# EAGLE schematic HW30A (EAGLE 7.5.0)
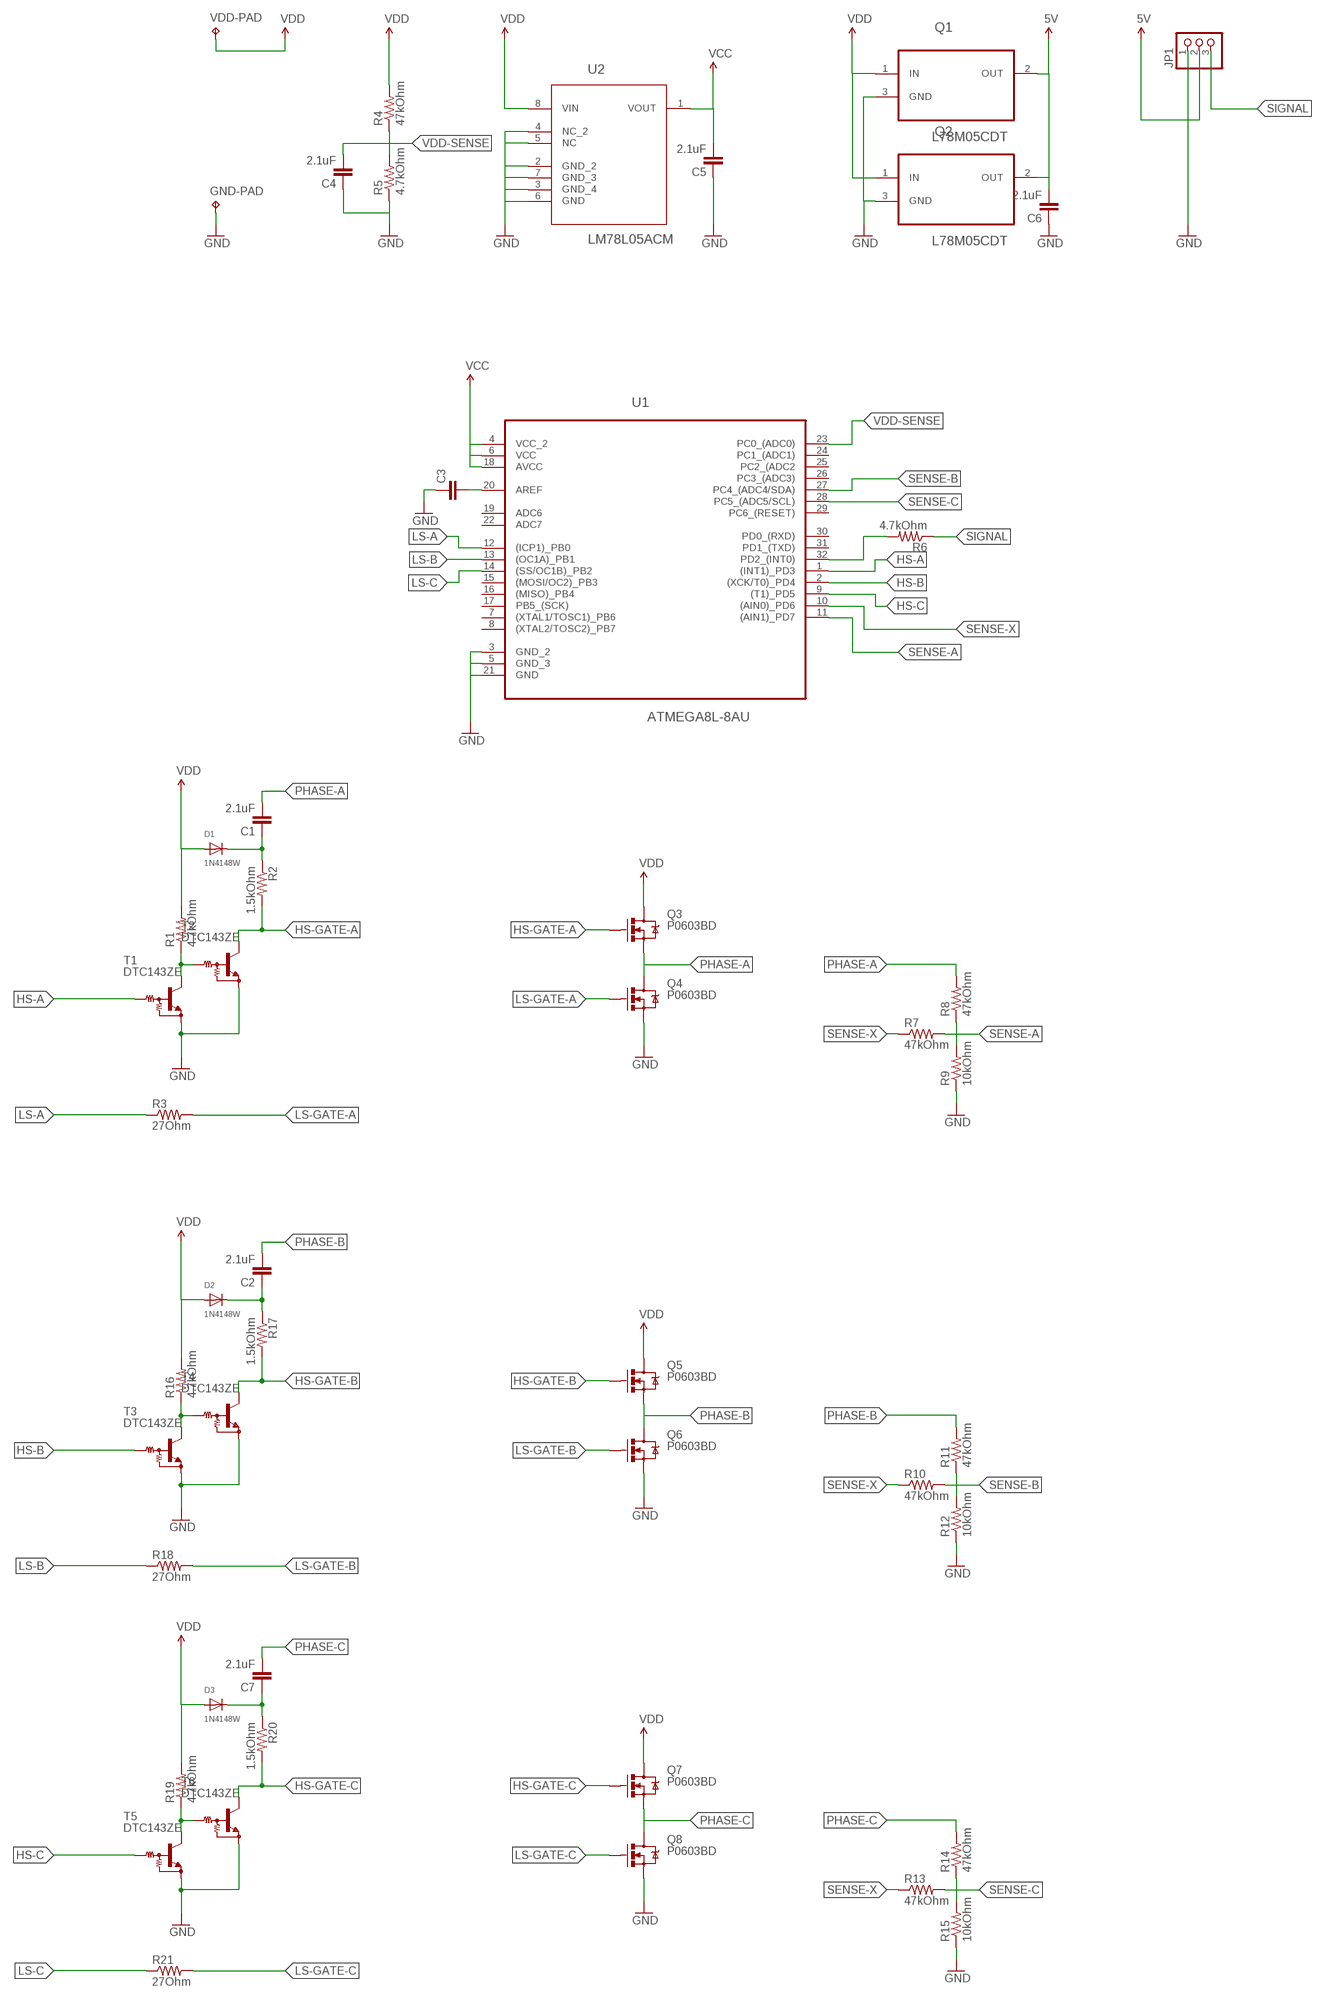
[diagram p0: schematic, sheet 1]

## Parts
C1  2.1uF  C-EUC0805K  [C0805K]
C2  2.1uF  C-EUC0805K  [C0805K]
C3  C-EUC0603K  [C0603K]
C4  2.1uF  C-EUC0805K  [C0805K]
C5  2.1uF  C-EUC0805K  [C0805K]
C6  2.1uF  C-EUC0805K  [C0805K]
C7  2.1uF  C-EUC0805K  [C0805K]
D1  1N4148W  DIODESOD-123  [SOD-123]
D2  1N4148W  DIODESOD-123  [SOD-123]
D3  1N4148W  DIODESOD-123  [SOD-123]
GND-PAD  TPTP20R  [TP20R]
JP1  PINHD-1X3CB  [1X03-CLEANBIG]
Q1  L78M05CDT  [TO225P972X240-3N]
Q2  L78M05CDT  [TO225P972X240-3N]
Q3  P0603BD  MOSFET-NCHANNELFDD8780  [DPAK]
Q4  P0603BD  MOSFET-NCHANNELFDD8780  [DPAK]
Q5  P0603BD  MOSFET-NCHANNELFDD8780  [DPAK]
Q6  P0603BD  MOSFET-NCHANNELFDD8780  [DPAK]
Q7  P0603BD  MOSFET-NCHANNELFDD8780  [DPAK]
Q8  P0603BD  MOSFET-NCHANNELFDD8780  [DPAK]
R1  4.7kOhm  R-US_R0603  [R0603]
R2  1.5kOhm  R-US_R0805  [R0805]
R3  27Ohm  R-US_R0603  [R0603]
R4  47kOhm  R-US_R0603  [R0603]
R5  4.7kOhm  R-US_R0603  [R0603]
R6  4.7kOhm  R-US_R0603  [R0603]
R7  47kOhm  R-US_R0603  [R0603]
R8  47kOhm  R-US_R0603  [R0603]
R9  10kOhm  R-US_R0603  [R0603]
R10  47kOhm  R-US_R0603  [R0603]
R11  47kOhm  R-US_R0603  [R0603]
R12  10kOhm  R-US_R0603  [R0603]
R13  47kOhm  R-US_R0603  [R0603]
R14  47kOhm  R-US_R0603  [R0603]
R15  10kOhm  R-US_R0603  [R0603]
R16  4.7kOhm  R-US_R0603  [R0603]
R17  1.5kOhm  R-US_R0805  [R0805]
R18  27Ohm  R-US_R0603  [R0603]
R19  4.7kOhm  R-US_R0603  [R0603]
R20  1.5kOhm  R-US_R0805  [R0805]
R21  27Ohm  R-US_R0603  [R0603]
T1  DTC143ZE  MUN2211T1-NPN_DRIVER-SC59-BEC  [SC59-BEC]
T2  DTC143ZE  MUN2211T1-NPN_DRIVER-SC59-BEC  [SC59-BEC]
T3  DTC143ZE  MUN2211T1-NPN_DRIVER-SC59-BEC  [SC59-BEC]
T4  DTC143ZE  MUN2211T1-NPN_DRIVER-SC59-BEC  [SC59-BEC]
T5  DTC143ZE  MUN2211T1-NPN_DRIVER-SC59-BEC  [SC59-BEC]
T6  DTC143ZE  MUN2211T1-NPN_DRIVER-SC59-BEC  [SC59-BEC]
U1  ATMEGA8L-8AU  [QFP80P900X900X120-32N]
U2  LM78L05ACM  [SOIC127P620X175-8N]
VDD-PAD  TPTP20R  [TP20R]

## Nets
5V: C6.2 JP1.2 Q1.2(OUT) Q2.2(OUT)
GND: C3.1 C4.1 C5.1 C6.1 GND-PAD.TP JP1.1 Q1.3(GND) Q2.3(GND) Q4.3(S) Q6.3(S) Q8.3(S) R5.1 R9.1 R12.1 R15.1 T1.E T2.E T3.E T4.E T5.E T6.E U1.3(GND_2) U1.5(GND_3) U1.21(GND) U2.2(GND_2) U2.3(GND_4) U2.4(NC_2) U2.5(NC) U2.6(GND) U2.7(GND_3)
HS-A: T1.B U1.1((INT1)_PD3)
HS-B: T3.B U1.2((XCK/T0)_PD4)
HS-C: T5.B U1.9((T1)_PD5)
HS-GATE-A: Q3.1(G) R2.2 T2.C
HS-GATE-B: Q5.1(G) R17.2 T4.C
HS-GATE-C: Q7.1(G) R20.2 T6.C
LS-A: R3.1 U1.12((ICP1)_PB0)
LS-B: R18.1 U1.13((OC1A)_PB1)
LS-C: R21.1 U1.14((SS/OC1B)_PB2)
LS-GATE-A: Q4.1(G) R3.2
LS-GATE-B: Q6.1(G) R18.2
LS-GATE-C: Q8.1(G) R21.2
N$1: R6.1
N$2: R1.1 T1.C T2.B
N$4: C1.1 D1.C R2.1
N$5: R16.1 T3.C T4.B
N$6: C3.2 U1.20(AREF)
N$7: C2.1 D2.C R17.1
N$9: R19.1 T5.C T6.B
N$10: C7.1 D3.C R20.1
PHASE-A: C1.2 Q3.3(S) Q4.4(D) R8.2
PHASE-B: C2.2 Q5.3(S) Q6.4(D) R11.2
PHASE-C: C7.2 Q7.3(S) Q8.4(D) R14.2
SENSE-A: R7.2 R8.1 R9.2 U1.11((AIN1)_PD7)
SENSE-B: R10.2 R11.1 R12.2 U1.27(PC4_(ADC4/SDA))
SENSE-C: R13.2 R14.1 R15.2 U1.28(PC5_(ADC5/SCL))
SENSE-X: R7.1 R10.1 R13.1 U1.10((AIN0)_PD6)
SIGNAL: JP1.3 R6.2 U1.32(PD2_(INT0))
VCC: C5.2 U1.4(VCC_2) U1.6(VCC) U1.18(AVCC) U2.1(VOUT)
VDD: D1.A D2.A D3.A Q1.1(IN) Q2.1(IN) Q3.4(D) Q5.4(D) Q7.4(D) R1.2 R4.2 R16.2 R19.2 U2.8(VIN) VDD-PAD.TP
VDD-SENSE: C4.2 R4.1 R5.2 U1.23(PC0_(ADC0))
Unconnected: U1.7((XTAL1/TOSC1)_PB6) U1.8((XTAL2/TOSC2)_PB7) U1.15((MOSI/OC2)_PB3) U1.16((MISO)_PB4) U1.17(PB5_(SCK)) U1.19(ADC6) U1.22(ADC7) U1.24(PC1_(ADC1)) U1.25(PC2_(ADC2) U1.26(PC3_(ADC3)) U1.29(PC6_(RESET)) U1.30(PD0_(RXD)) U1.31(PD1_(TXD))

## Library data of the parts
C1 C2 C4-C7 = resistor:C-EU: CAPACITOR, European symbol
C3 = rcl:C-EU: CAPACITOR, European symbol
D1-D3 = adafruit:DIODE: Diode SMADIODE - SMA Surface Mount Package 20V 1A Schottky Diode Digikey: 641-1014-6-ND DO-1N4148 - Through Hole Small Current Diode SOD-123 20V 1 A (.5mV Vf) Schottky Diode - Digikey: MBRX120TPMSCT-ND SOD-323 10V 570mA (.38mV Vf, 3ns) Schottky Diode - Digikey: ZLLS410CT-ND SOD-523 30V 30mA Schottky Diode (RB751S-40TE61) - Digikey: RB751S-40TE61CT-ND SOT23-R/W - SOT23 Package (R = Solder Paste/Reflow Ovens, W = Hand-Soldering) BAT54Film 40V 300mA - Digikey: 497-7162-1-ND
GND-PAD VDD-PAD = testpad:TP: Test pad
JP1 = adafruit:PINHD-1X3: PIN HEADER
Q1 Q2 = ST Microelctronics_By_element14_Batch_1:L78M05CDT: Positive voltage regulators; MPN: L78M05CDT; OC_FARNELL: 1087116; OC_NEWARK: 78K5325; PACKAGE: DPAK; SUPPLIER: STMICROELECTRONICS
Q3-Q8 = SparkFun-DiscreteSemi:MOSFET-NCHANNEL: Common NMOSFET Parts MFG P/N Store ID Prod ID FDD8780 TRANS-09984 SI7820DN TRANS-11055 FDS6630A IC-08089 2N7002PW TRANS-11151 FQP30N06L COM-10213 TRANS-10060 BSS123LT1G TRANS-08345 BSS138 TRANS-00830 BS170 2N7000; PROD_ID: TRANS-09984
R1-R21 = resistor:R-US_: RESISTOR, American symbol
T1-T6 = transistor:*-NPN_DRIVER-: NPN Bias Resistor Transistor
U1 = Atmel_By_element14_Batch_1-00:ATMEGA8L-8AU: 8-bit with 8KBytes In-System Programmable Flash; MPN: ATMEGA8L-8AU; OC_FARNELL: 9171525; OC_NEWARK: 68T3210; PACKAGE: QFP-32; SUPPLIER: Atmel
U2 = NSC_By_element14_Batch_1.1:LM78L05ACM: 3-Terminal Positive Regulators; MPN: LM78L05ACM; OC_FARNELL: 9489436; OC_NEWARK: -; PACKAGE: SOIC-8; SUPPLIER: National Semiconductor